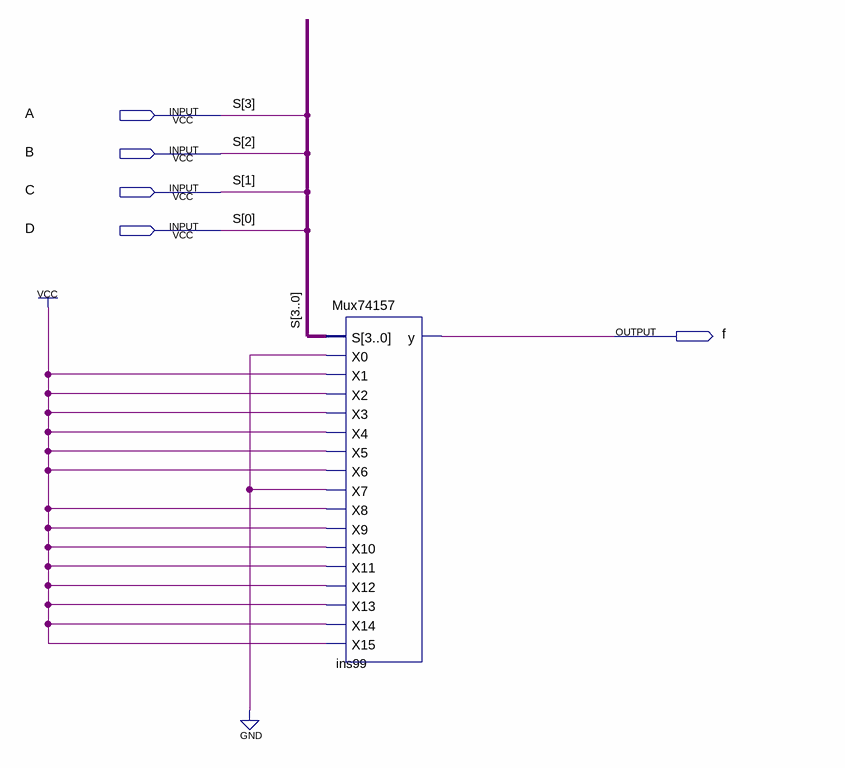
[diagram p0: schematic sheet]
// Quartus schematic Mux74157funcao.bdf as structural Verilog: 1 symbols, 5 pins
module Mux74157funcao (
  input  A,
  input  B,
  input  C,
  input  D,
  output f
);

  Mux74157 ins99 (
    .S({A, B, C, D}), .X0(1'b0), .X1(1'b1), .X2(1'b1), .X3(1'b1), .X4(1'b1), .X5(1'b1), .X6(1'b1), .X7(1'b0),
    .X8(1'b1), .X9(1'b1), .X10(1'b1), .X11(1'b1), .X12(1'b1), .X13(1'b1), .X14(1'b1), .X15(1'b1), .y(f));

  // Other names for the same wires on the sheet: S[3:0] = {A, B, C, D}
endmodule
